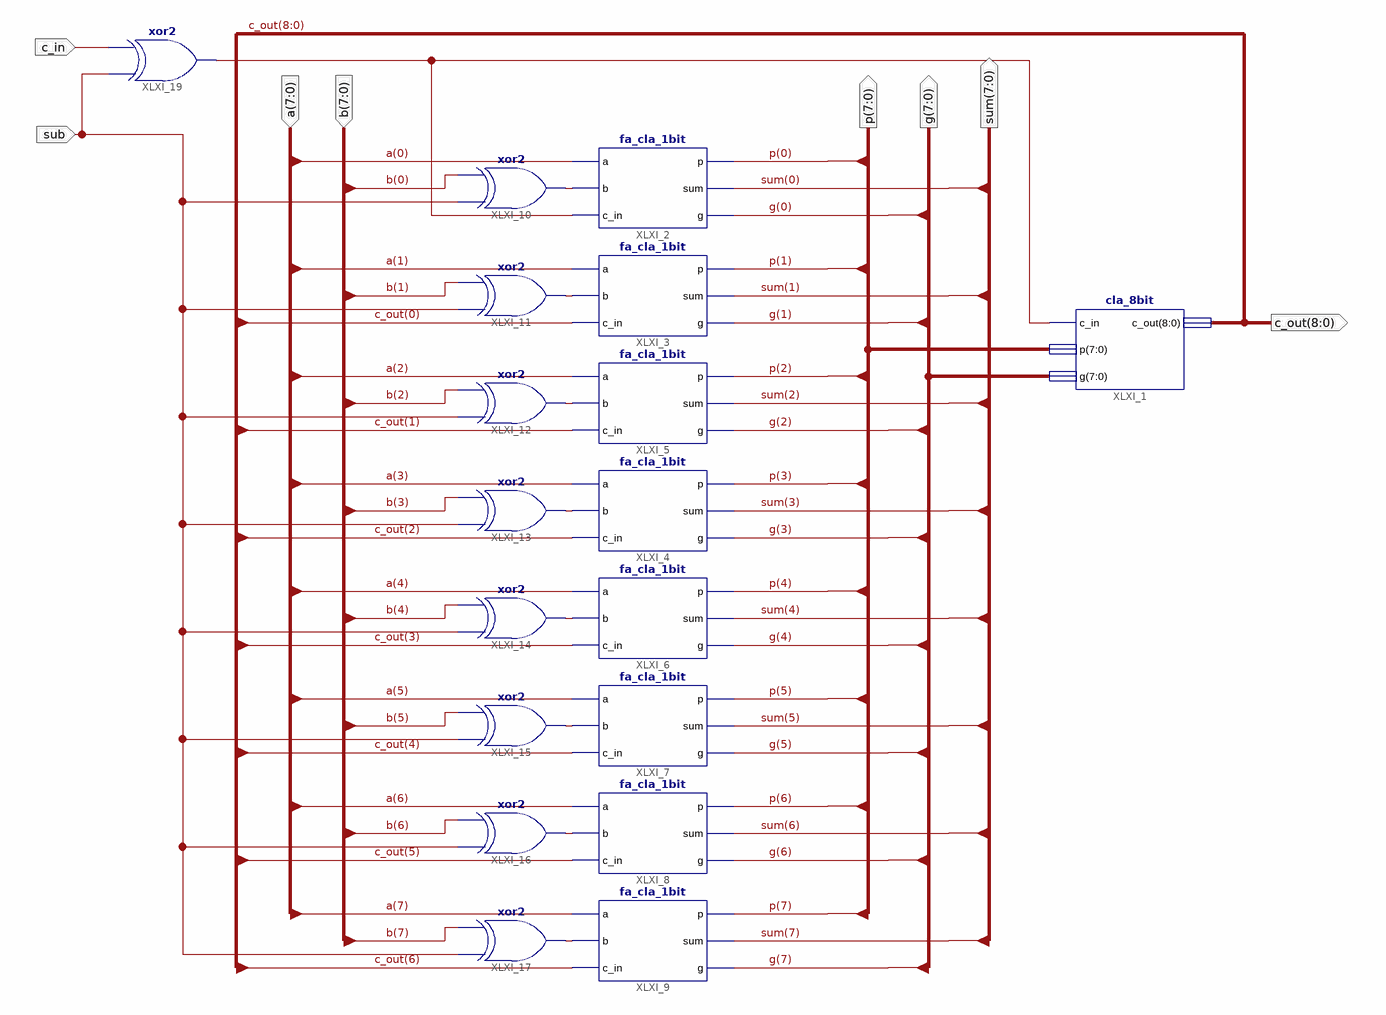
[diagram p0: schematic sheet 1]
// Xilinx ISE schematic fa_cla_8bit_v2.sch (spartan3e) as structural Verilog: 18 symbols, 8 ports
module fa_cla_8bit_v2 (
  input  [7:0] b,
  input  [7:0] a,
  input  sub,
  input  c_in,
  output [8:0] c_out,
  output [7:0] p,
  output [7:0] g,
  output [7:0] sum
);

  wire XLXN_27, XLXN_29, XLXN_30, XLXN_31, XLXN_32, XLXN_33, XLXN_34, XLXN_35, XLXN_96;

  cla_8bit XLXI_1 (.c_in(XLXN_96), .p(p), .g(g), .c_out(c_out));
  fa_cla_1bit XLXI_2 (.c_in(XLXN_96), .p(p[0]), .sum(sum[0]), .g(g[0]), .b(XLXN_27), .a(a[0]));
  fa_cla_1bit XLXI_3 (.c_in(c_out[0]), .p(p[1]), .sum(sum[1]), .g(g[1]), .b(XLXN_29), .a(a[1]));
  fa_cla_1bit XLXI_4 (.c_in(c_out[2]), .p(p[3]), .sum(sum[3]), .g(g[3]), .b(XLXN_31), .a(a[3]));
  fa_cla_1bit XLXI_5 (.c_in(c_out[1]), .p(p[2]), .sum(sum[2]), .g(g[2]), .b(XLXN_30), .a(a[2]));
  fa_cla_1bit XLXI_6 (.c_in(c_out[3]), .p(p[4]), .sum(sum[4]), .g(g[4]), .b(XLXN_32), .a(a[4]));
  fa_cla_1bit XLXI_7 (.c_in(c_out[4]), .p(p[5]), .sum(sum[5]), .g(g[5]), .b(XLXN_33), .a(a[5]));
  fa_cla_1bit XLXI_8 (.c_in(c_out[5]), .p(p[6]), .sum(sum[6]), .g(g[6]), .b(XLXN_34), .a(a[6]));
  fa_cla_1bit XLXI_9 (.c_in(c_out[6]), .p(p[7]), .sum(sum[7]), .g(g[7]), .b(XLXN_35), .a(a[7]));
  xor XLXI_10 (XLXN_27, sub, b[0]);
  xor XLXI_11 (XLXN_29, sub, b[1]);
  xor XLXI_12 (XLXN_30, sub, b[2]);
  xor XLXI_13 (XLXN_31, sub, b[3]);
  xor XLXI_14 (XLXN_32, sub, b[4]);
  xor XLXI_15 (XLXN_33, sub, b[5]);
  xor XLXI_16 (XLXN_34, sub, b[6]);
  xor XLXI_17 (XLXN_35, sub, b[7]);
  xor XLXI_19 (XLXN_96, sub, c_in);
endmodule
